# EasyEDA Pro project ProPrj_Smart_medcil_2024-12-30.epro

# Schematic Schematic1
Board Name: Board1; Create Date: 2024-12-29
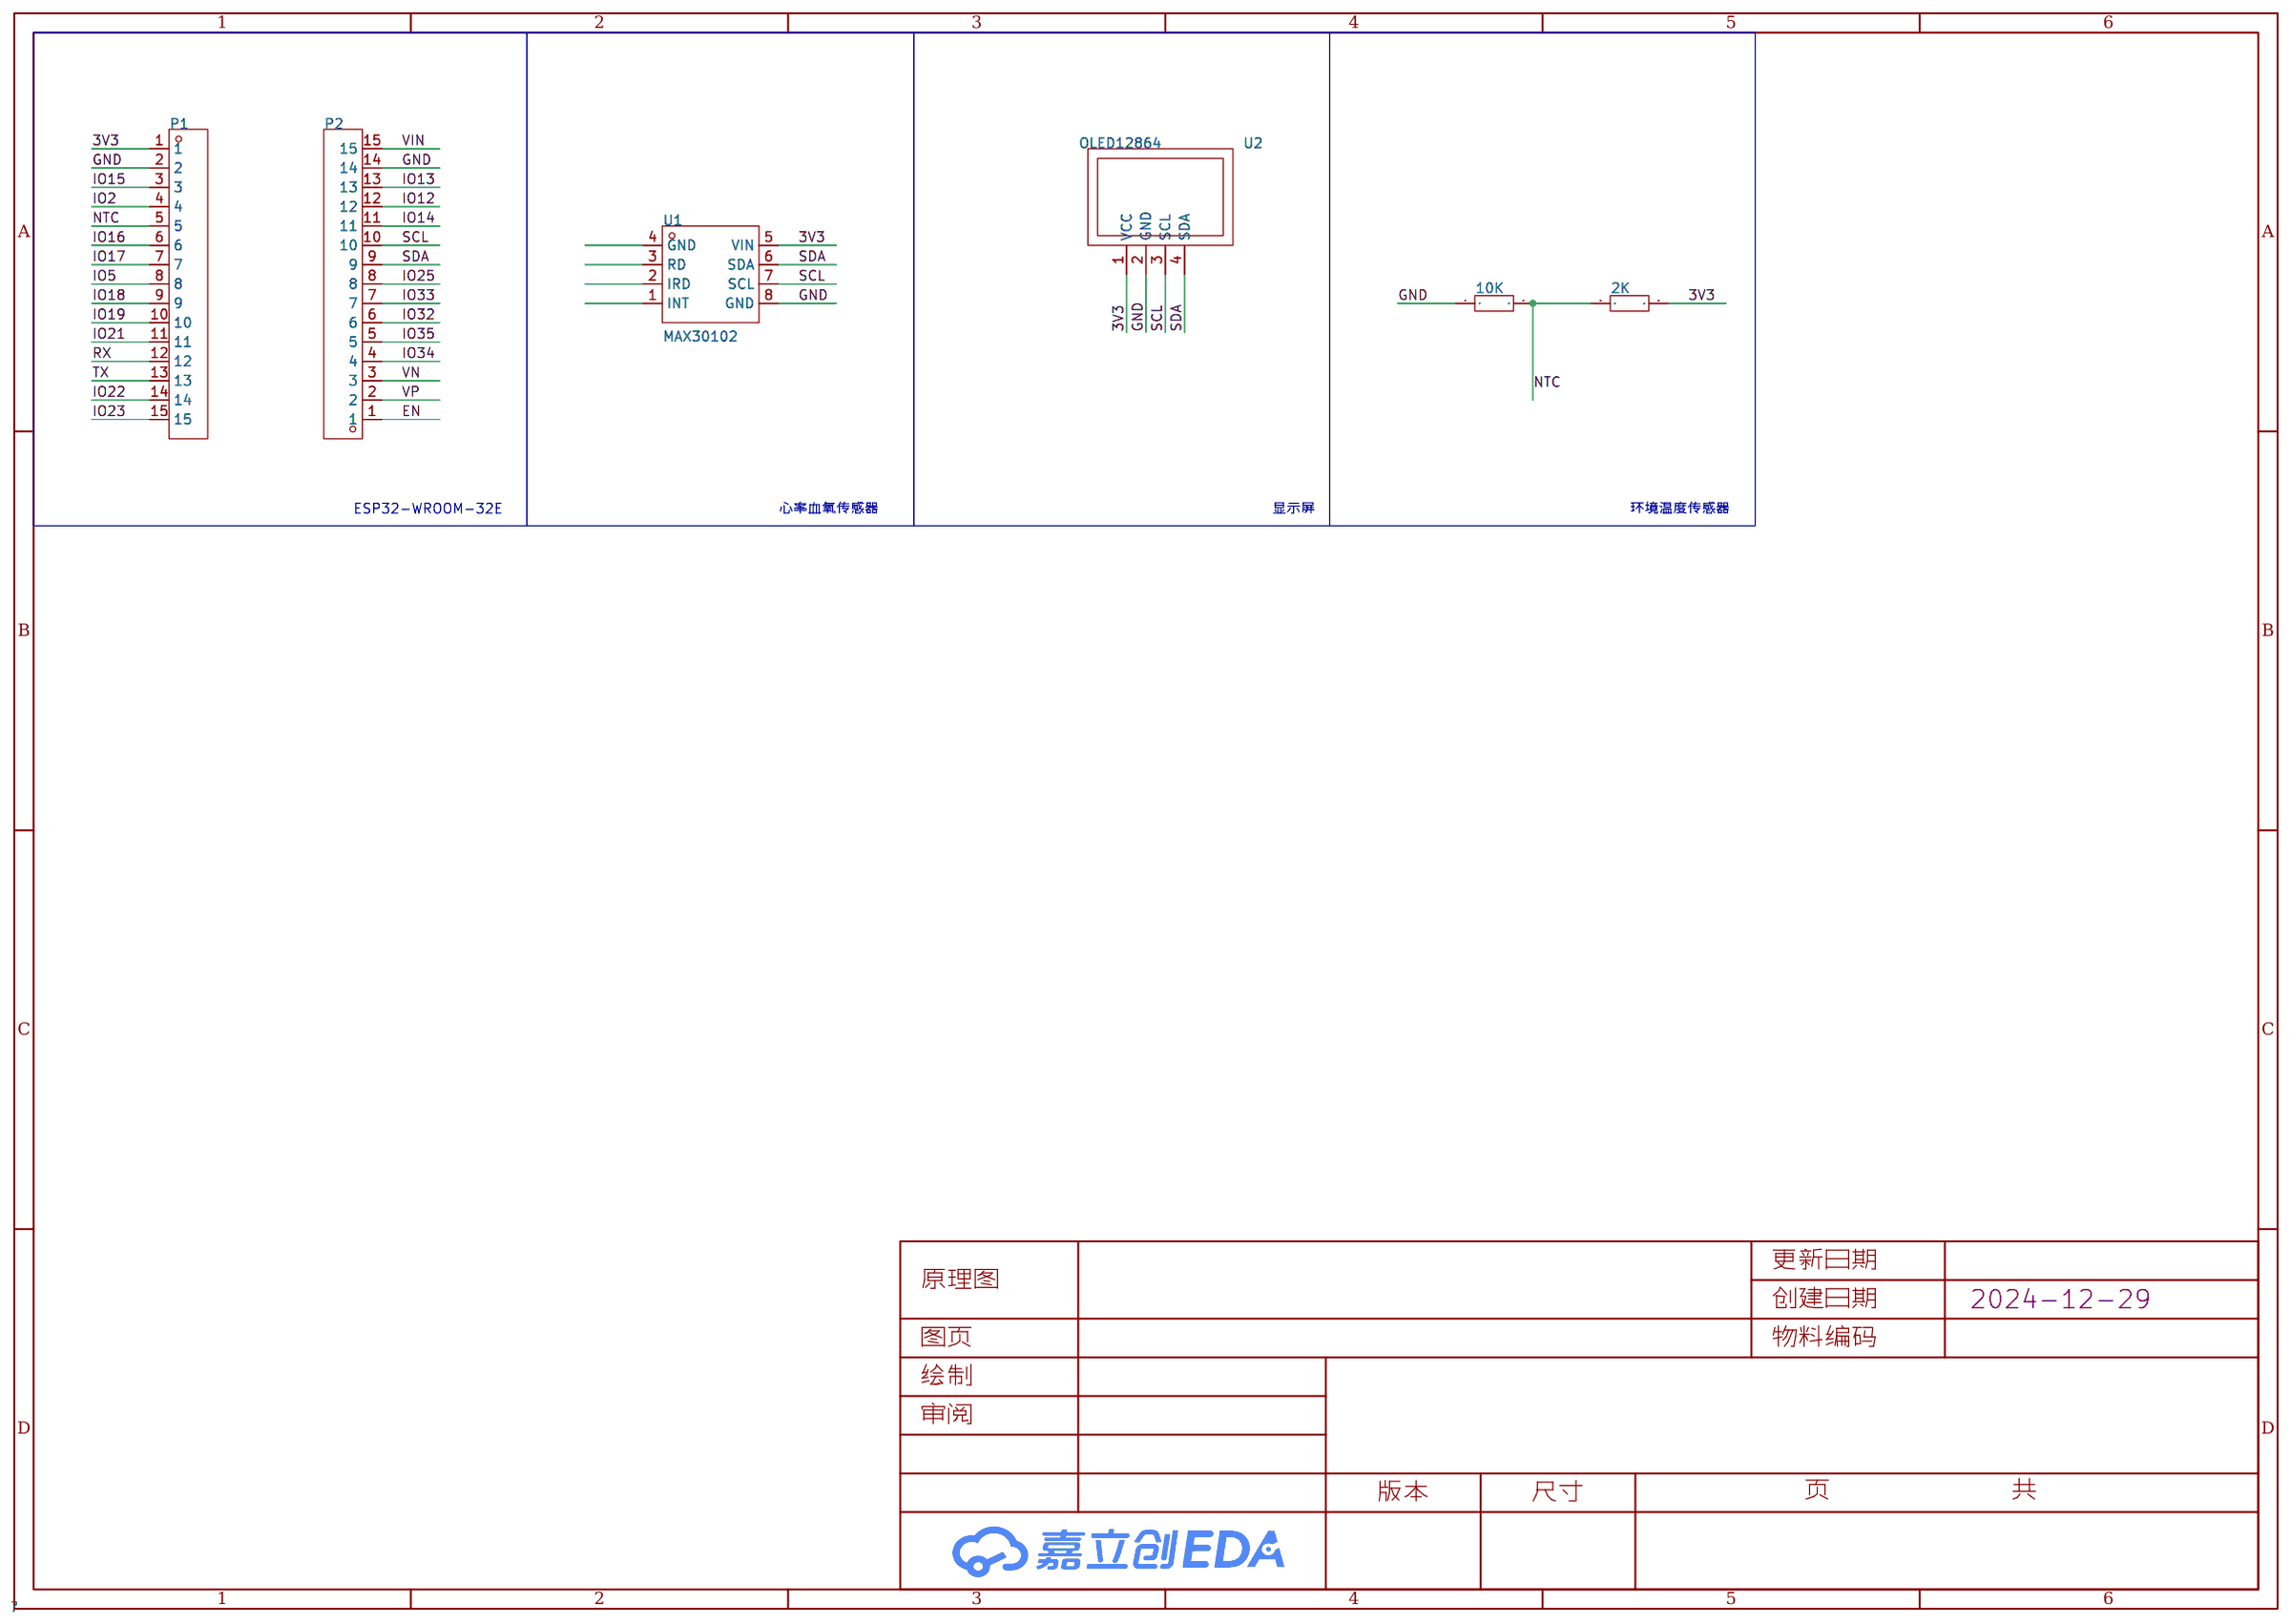
[diagram p0: schematic sheet]

## Parts
2K  -  [RES-TH_BD2.3-L6.5-P10.50-D0.5]
10K  10K  [footprint_c2d9]
P1  排针15pin  [排针15PIN]
P2  排针15pin  [排针15PIN]
U1  MAX30102  [MAX30102]
U2  OLED12864  [OLED12864模块I2C]

## Library data of the parts
2K = 10K插件电阻
10K = 10K: Supplier: LCSC; Manufacturer: UniOhm; Manufacturer Part: 0603WAF1002T5E; Supplier Part: C25804
P1 P2 = 排针15pin
U1 = MAX30102: _: 3
U2 = OLED12864

## Nets
3V3: 2K.2 P1.1 U1.5(VIN) U2.1(VCC)
GND: 10K.1 P1.2 P2.14 U1.8(GND) U2.2(GND)
VIN: P2.15
EN: P2.1
IO2: P1.4
IO5: P1.8
IO12: P2.12
IO13: P2.13
IO14: P2.11
IO15: P1.3
IO16: P1.6
IO17: P1.7
IO18: P1.9
IO19: P1.10
IO21: P1.11
IO22: P1.14
IO23: P1.15
IO25: P2.8
IO32: P2.6
IO33: P2.7
IO34: P2.4
IO35: P2.5
NTC: 2K.1 10K.2 P1.5
RX: P1.12
SCL: P2.10 U1.7(SCL) U2.3(SCL)
SDA: P2.9 U1.6(SDA) U2.4(SDA)
TX: P1.13
VN: P2.3
VP: P2.2

Not connected (* = marked no-connect by the designer): U1 1(INT) 2(IRD) 3(RD) 4(GND)

## Notes on the sheet
- ESP32-WROOM-32E
- 心率血氧传感器
- 显示屏
- 环境温度传感器

# Board PCB1
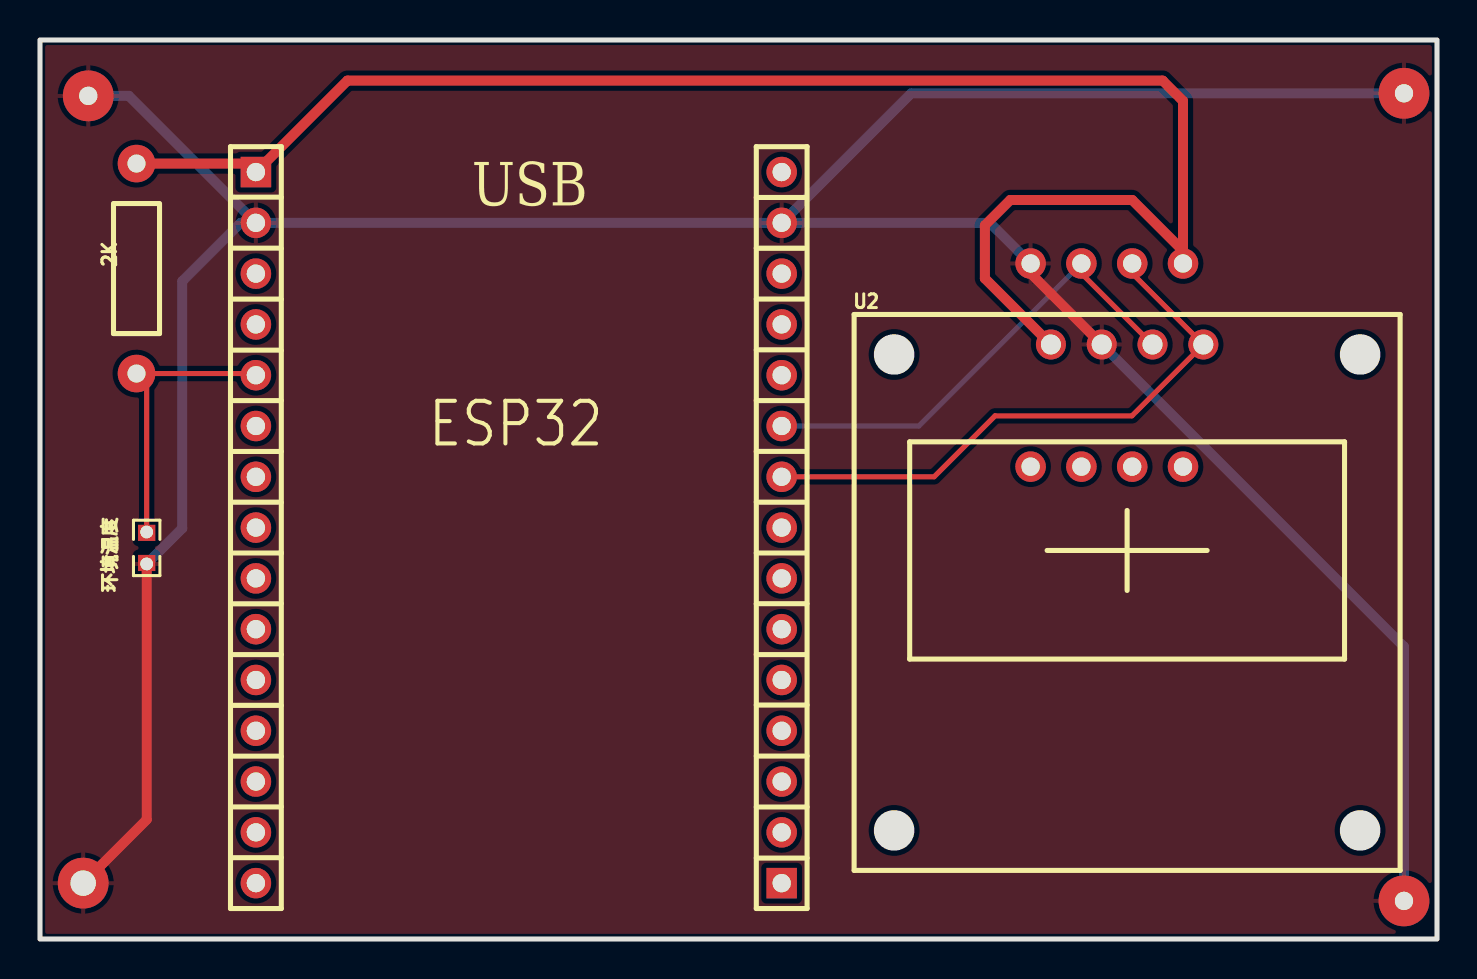
[diagram p1: board, top side]
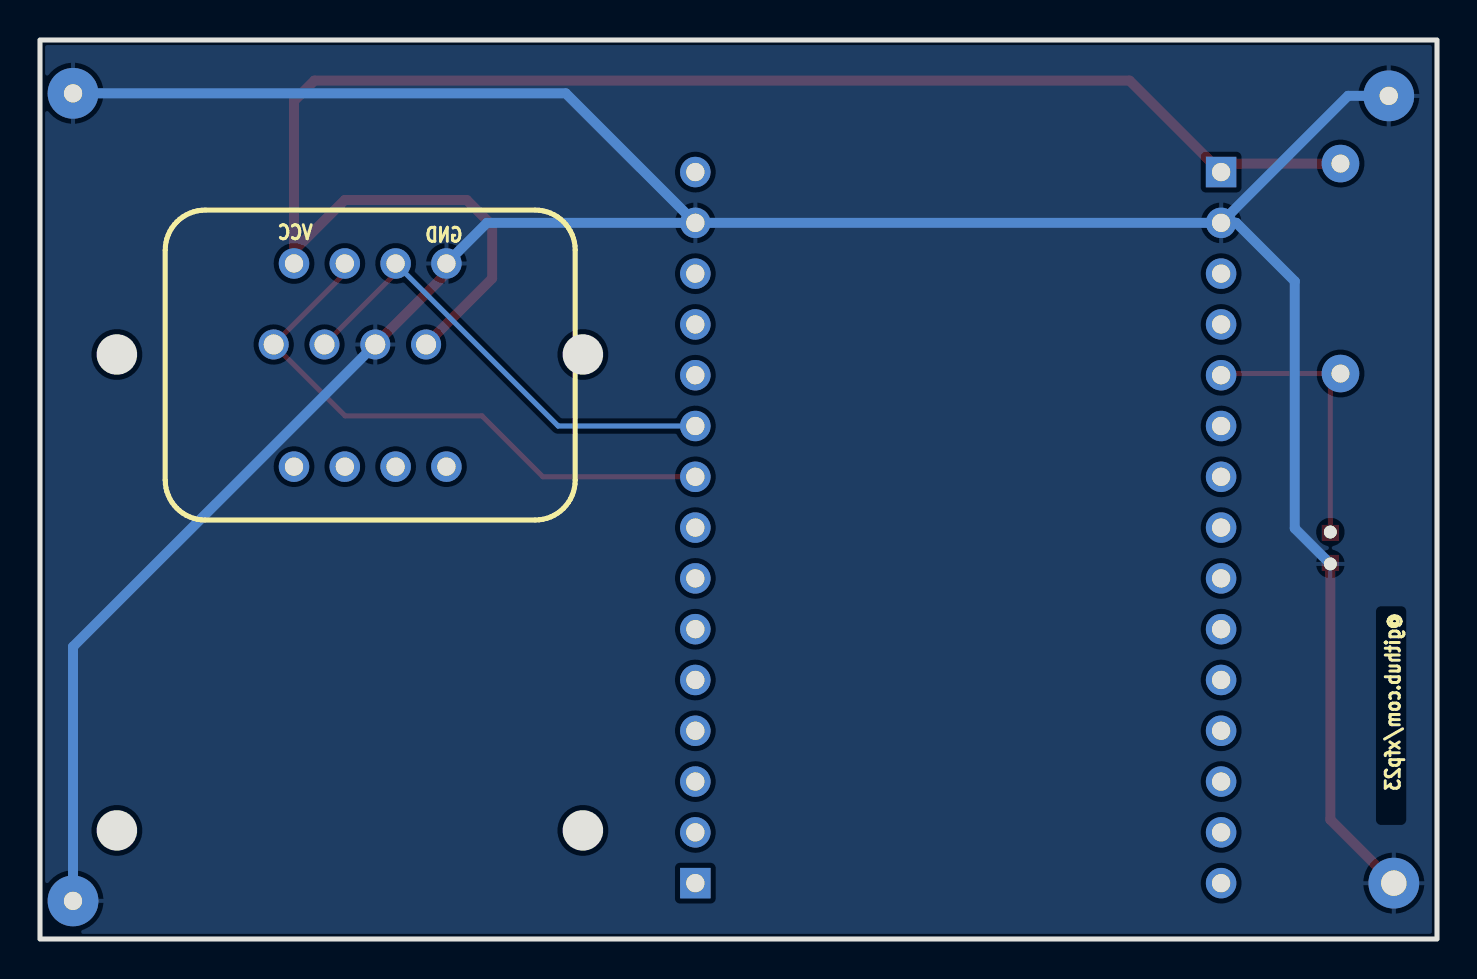
[diagram p2: board, bottom side, seen from below]

Outline 69.85 x 44.96 mm; copper layers: Top Layer, Bottom Layer. Coordinates in mm from the lower left corner of the outline.
Outline path: rectangle 0,44.96 69.85,0
Stack: Top Layer 0.035mm / Dielectric1 1.51mm FR4 er 4.5 / Bottom Layer 0.035mm

## Design rules (mm)
template: JLCPCB Capability(Two Layers Board)
spacing copperThickness1oz (default): track to track 0.102, other pairs 0.152 to 0.3
spacing copperThickness2oz: track to track 0.203, other pairs 0.152 to 0.3
track width copperThickness1oz (default): min 0.127, default 0.254, max 2.54
track width copperThickness2oz: min 0.203, default 0.254, max 2.54
differential pair differentialPair (default): width min 0.127, default 0.254, max 2.54; gap min 0.152, default 0.152
via viaSize (default): diameter min 0.5, default 0.61, max 10; hole min 0.3, default 0.305, max 6.3

## Placement (name value [footprint] x y rotation side)
2K  -  [RES-TH_BD2.3-L6.5-P10.50-D0.5]  4.83 33.53 90 top
NOREF  -  [Pad_e10]  5.33 18.76 0 top
NOREF#2  -  [Pad_e17]  68.2 42.29 0 top
NOREF#3  -  [Pad_e9]  5.33 20.35 0 top
NOREF#4  -  [Pad_e16]  68.2 1.91 0 top
NOREF#5  -  [Pad_e15]  2.16 2.79 0 top
NOREF#6  -  [Pad_e14]  2.41 42.16 0 top
P1  排针15pin  [排针15PIN]  9.53 39.62 0 top
P2  排针15pin  [排针15PIN]  38.35 1.52 180 top
U1  -  [MAX30102]  53.34 28.7 0 bottom
U2  OLED12864  [OLED12864模块I2C]  54.36 19.43 0 top
环境温度  10K  [footprint_c2d9]  5.33 19.56 90 top

## Footprints (pads in the part's own frame, mm; a bottom-side part is the same pattern mirrored in y, then rotated)
footprint_c2d9
  rect 0.806x0.864 smd: 1(-0.753,0) 2(0.753,0)
MAX30102
  round 1.524 hole 0.914: 1(-3.81,5.08) 2(-1.27,5.08) 3(1.27,5.08) 4(3.81,5.08) 5(3.81,-5.08) 6(1.27,-5.08) 7(-1.27,-5.08) 8(-3.81,-5.08)
OLED12864模块I2C
  round 1.5 hole 1: 1(-3.81,10.3) 2(-1.27,10.3) 3(1.27,10.3) 4(3.81,10.3)
Pad_e9
  round 0.635 hole 0.914: 1(0,0)
Pad_e10
  round 0.635 hole 0.914: 2(0,0)
Pad_e14
  round 2.54 hole 0.914: 1(0,0)
Pad_e15
  round 2.54 hole 1.27: 2(0,0)
Pad_e16
  round 2.54 hole 0.914: 3(0,0)
Pad_e17
  round 2.54 hole 0.914: 4(0,0)
RES-TH_BD2.3-L6.5-P10.50-D0.5
  round 1.879 hole 0.899: 1(-5.25,0) 2(5.25,0)
排针15PIN
  rect 1.524x1.524 hole 0.914: 1(1.27,-1.27)
  round 1.524 hole 0.914: 2(1.27,-3.81) 3(1.27,-6.35) 4(1.27,-8.89) 5(1.27,-11.43) 6(1.27,-13.97) 7(1.27,-16.51) 8(1.27,-19.05) 9(1.27,-21.59) 10(1.27,-24.13) 11(1.27,-26.67) 12(1.27,-29.21) 13(1.27,-31.75) 14(1.27,-34.29) 15(1.27,-36.83)

## Nets
As in the schematic, except:
GND: NOREF.2 NOREF#2.4 NOREF#4.3 NOREF#5.2 NOREF#6.1 P1.2 P2.14 U1.8 U2.2 环境温度.1
NTC: 2K.1 NOREF#3.1 P1.5 环境温度.2

## Routing (per net, layer and track width the routed paths; a pad name or vN(x,y) marks a point on that pad's centre or on a via; arc(x,y) is an arc through that point)
3V3: length 81.8
  Top Layer w0.254: 57.15,34.42 57.15,33.78
  Top Layer w0.5: 2K.2 10.37,38.78 P1.1 15.37,42.93 56.13,42.93 57.15,41.91 57.15,34.42 54.61,36.96 48.51,36.96 47.24,35.69 47.24,33.03 50.55,29.73
GND: length 161
  Top Layer w0.5: NOREF#5.2 5.33,5.97 NOREF.2 ; 53.09,29.73 49.53,33.29 U1.8
  Bottom Layer w0.5: P1.2 4.45,42.16 NOREF#6.1 ; P1.2 37.08,35.81 ; P1.2 10.03,35.81 7.11,32.89 7.11,20.54 NOREF.2 ; 37.08,35.81 47.5,35.81 U1.8 ; 37.08,35.81 43.56,42.29 NOREF#2.4 ; NOREF#4.3 68.2,14.62 53.09,29.73
NTC: length 14.1
  Top Layer w0.254: NOREF#3.1 5.33,27.77 2K.1 10.71,28.28 P1.5
SCL: length 23.9
  Top Layer w0.254: 55.63,29.73 52.07,33.29 U1.7
  Bottom Layer w0.254: 37.08,25.65 43.94,25.65 U1.7
SDA: length 29.3
  Top Layer w0.254: 54.61,33.78 54.61,33.29 58.17,29.73 54.6,26.16 47.75,26.16 44.7,23.11 37.08,23.11

## Copper pours and planes (outline as drawn; the poured copper is in the pictures)
GND on Top Layer: 0,44.76 69.85,44.76 69.85,0 0,0
GND on Bottom Layer: 0,44.96 69.85,44.96 69.85,0 0,0

## Text on the board
Bottom Silkscreen Layer: @github.com/xfp23 | GND | VCC
Top Silkscreen Layer: ESP32 | USB
